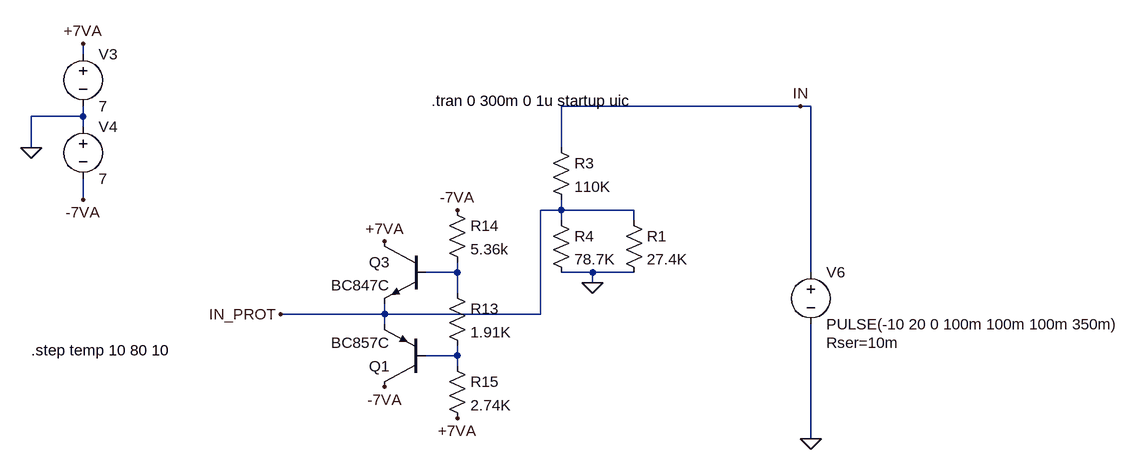
[diagram p0: schematic ONLY_CLIPPING.asc]
ONLY_CLIPPING.asc, the LTspice schematic file:
Version 4
SHEET 1 1792 1140
WIRE -432 384 -432 368
WIRE 672 464 304 464
WIRE 688 464 672 464
WIRE -432 480 -432 464
WIRE -432 480 -512 480
WIRE -432 496 -432 480
WIRE -512 528 -512 480
WIRE 304 528 304 464
WIRE -432 608 -432 576
WIRE 304 624 304 608
WIRE 304 624 272 624
WIRE 416 624 304 624
WIRE 304 640 304 624
WIRE 416 640 416 624
WIRE 144 720 144 704
WIRE 144 720 96 720
WIRE 352 720 304 720
WIRE 416 720 352 720
WIRE 688 720 688 464
WIRE 352 736 352 720
WIRE 144 752 144 720
WIRE 32 784 32 768
WIRE 32 784 -128 784
WIRE 272 784 272 624
WIRE 272 784 32 784
WIRE 32 800 32 784
WIRE 144 848 144 832
WIRE 144 848 96 848
WIRE 144 864 144 848
WIRE 688 976 688 800
FLAG -512 528 0
FLAG 352 736 0
FLAG -432 368 +7VA
FLAG -432 608 -7VA
FLAG 688 976 0
FLAG 32 672 +7VA
FLAG 144 944 +7VA
FLAG 144 624 -7VA
FLAG 672 464 IN
FLAG -128 784 IN_PROT
FLAG 32 896 -7VA
SYMBOL voltage -432 368 R0
WINDOW 123 0 0 Left 2
WINDOW 39 0 0 Left 2
SYMATTR InstName V3
SYMATTR Value 7
SYMBOL voltage -432 480 R0
WINDOW 123 0 0 Left 2
WINDOW 39 0 0 Left 2
SYMATTR InstName V4
SYMATTR Value 7
SYMBOL res 288 512 R0
SYMATTR InstName R3
SYMATTR Value 110K
SYMBOL res 288 624 R0
SYMATTR InstName R4
SYMATTR Value 78.7K
SYMBOL pnp 96 896 R180
SYMATTR InstName Q1
SYMATTR Value BC857C
SYMBOL npn 96 672 M0
SYMATTR InstName Q3
SYMATTR Value BC847C
SYMBOL voltage 688 704 R0
WINDOW 123 0 0 Left 2
WINDOW 39 24 124 Left 2
SYMATTR SpiceLine Rser=10m
SYMATTR InstName V6
SYMATTR Value PULSE(-10 20 0 100m 100m 100m 350m)
SYMBOL res 128 736 R0
SYMATTR InstName R13
SYMATTR Value 1.91K
SYMBOL res 128 608 R0
SYMATTR InstName R14
SYMATTR Value 5.36k
SYMBOL res 128 848 R0
SYMATTR InstName R15
SYMATTR Value 2.74K
SYMBOL res 400 624 R0
SYMATTR InstName R1
SYMATTR Value 27.4K
TEXT 104 456 Left 2 !.tran 0 300m 0 1u startup uic
TEXT -512 840 Left 2 !.step temp 10 80 10

The netlist it stands for:
* ONLY_CLIPPING.asc
V3 +7VA 0 7
V4 0 -7VA 7
R3 IN IN_PROT 110K
R4 IN_PROT 0 78.7K
Q1 -7VA N002 IN_PROT 0 BC857C
Q3 +7VA N001 IN_PROT 0 BC847C
V6 IN 0 PULSE(-10 20 0 100m 100m 100m 350m) Rser=10m
R13 N001 N002 1.91K
R14 -7VA N001 5.36k
R15 N002 +7VA 2.74K
R1 IN_PROT 0 27.4K
.model NPN NPN
.model PNP PNP
.lib standard.bjt
.tran 0 300m 0 1u startup uic
.step temp 10 80 10
.backanno
.end